# EAGLE design rov_control (EAGLE 6.4)
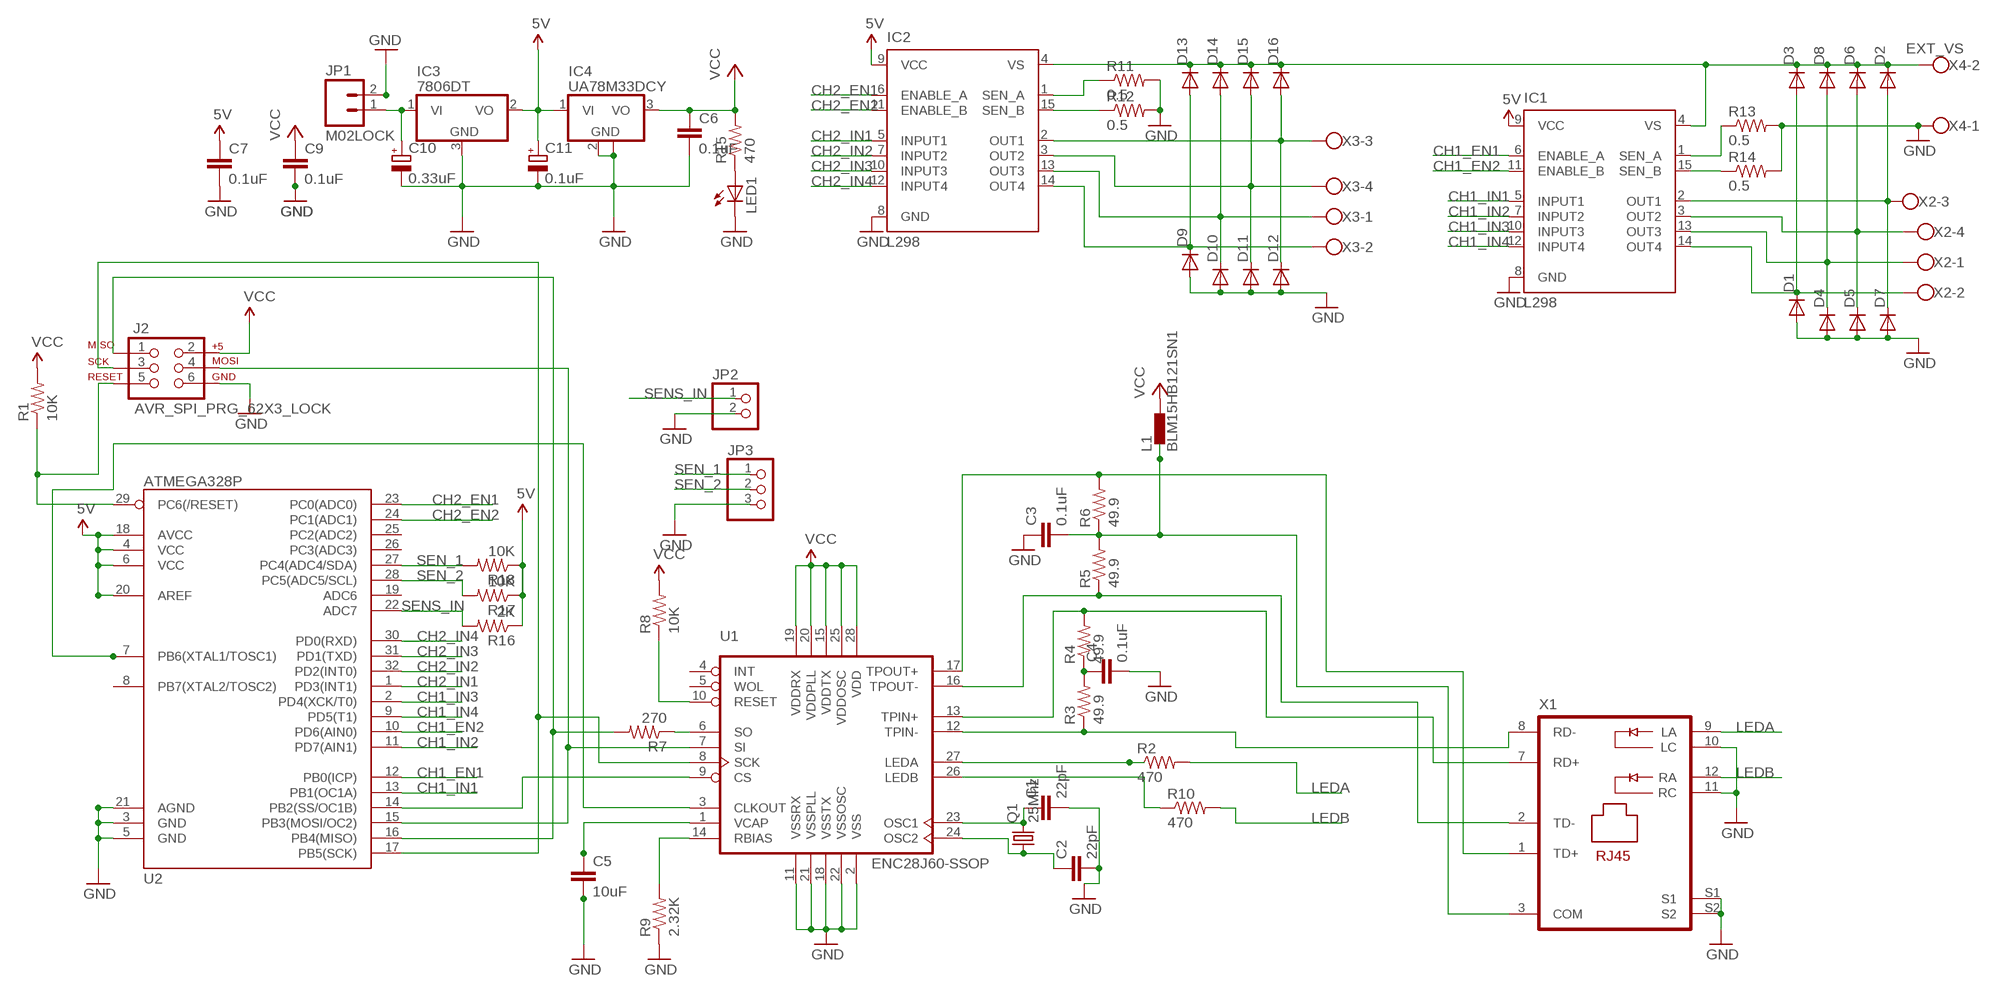
[diagram p0: schematic, sheet 1]

## Parts
C1  22pF  CAP0805  [0805]
C2  22pF  CAP0805  [0805]
C3  0.1uF  CAP0805  [0805]
C4  0.1uF  CAP0805  [0805]
C5  10uF  CAP0805  [0805]
C6  0.1uF  CAP0805  [0805]
C7  0.1uF  CAP0805  [0805]
C9  0.1uF  CAP0805  [0805]
C10  0.33uF  CPOL-EUA  [PANASONIC_A]
C11  0.1uF  CPOL-EUA  [PANASONIC_A]
D1  DIODESMA  [SMA-DIODE]
D2  DIODESMA  [SMA-DIODE]
D3  DIODESMA  [SMA-DIODE]
D4  DIODESMA  [SMA-DIODE]
D5  DIODESMA  [SMA-DIODE]
D6  DIODESMA  [SMA-DIODE]
D7  DIODESMA  [SMA-DIODE]
D8  DIODESMA  [SMA-DIODE]
D9  DIODESMA  [SMA-DIODE]
D10  DIODESMA  [SMA-DIODE]
D11  DIODESMA  [SMA-DIODE]
D12  DIODESMA  [SMA-DIODE]
D13  DIODESMA  [SMA-DIODE]
D14  DIODESMA  [SMA-DIODE]
D15  DIODESMA  [SMA-DIODE]
D16  DIODESMA  [SMA-DIODE]
IC1  L298  [MULTIWATT-15]
IC2  L298  [MULTIWATT-15]
IC3  7806DT  [TO252]
IC4  UA78M33DCY  [SOT223]
J2  AVR_SPI_PRG_62X3_LOCK  [2X3_LOCK]
JP1  M02LOCK  [1X02_LOCK]
JP2  PINHD-1X2  [1X02]
JP3  PINHD-1X3  [1X03]
L1  BLM15HB121SN1  [0402]
LED1  LEDSML0805  [SML0805]
Q1  25Mhz  CRYSTALHC49UP  [HC49UP]
R1  10K  RESISTOR0805-RES  [0805]
R2  470  RESISTOR0805-RES  [0805]
R3  49.9  RESISTOR0805-RES  [0805]
R4  49.9  RESISTOR0805-RES  [0805]
R5  49.9  RESISTOR0805-RES  [0805]
R6  49.9  RESISTOR0805-RES  [0805]
R7  270  RESISTOR0805-RES  [0805]
R8  10K  RESISTOR0805-RES  [0805]
R9  2.32K  RESISTOR0805-RES  [0805]
R10  470  RESISTOR0805-RES  [0805]
R11  0.5  RESISTOR0805-RES  [0805]
R12  0.5  RESISTOR0805-RES  [0805]
R13  0.5  RESISTOR0805-RES  [0805]
R14  0.5  RESISTOR0805-RES  [0805]
R15  470  RESISTOR0805-RES  [0805]
R16  2K  RESISTOR0805-RES  [0805]
R17  10K  RESISTOR0805-RES  [0805]
R18  10K  RESISTOR0805-RES  [0805]
U1  ENC28J60-SSOP  [SSOP28]
U2  ATMEGA328P  ATMEGA328_SMT  [TQFP32-08]
X1  LU1T041X  [PJ-J0]
X2  W237-4  [W237-4]
X3  W237-4  [W237-4]
X4  EXT_VS  W237-102  [W237-102]

## Nets
5V: C7.1 C11.+ IC1.9(VCC) IC2.9(VCC) IC3.2(VO) IC4.1(VI) R16.1 R17.1 R18.1 U2.4(VCC) U2.6(VCC) U2.18(AVCC) U2.20(AREF)
CH1_EN1: IC1.6(ENABLE_A) U2.12(PB0(ICP))
CH1_EN2: IC1.11(ENABLE_B) U2.10(PD6(AIN0))
CH1_IN1: IC1.5(INPUT1) U2.13(PB1(OC1A))
CH1_IN2: IC1.7(INPUT2) U2.11(PD7(AIN1))
CH1_IN3: IC1.10(INPUT3) U2.2(PD4(XCK/T0))
CH1_IN4: IC1.12(INPUT4) U2.9(PD5(T1))
CH1_OUT1: D2.A D7.C IC1.2(OUT1) X2.3
CH1_OUT2: D4.C D8.A IC1.13(OUT3) X2.1
CH1_OUT3: D5.C D6.A IC1.3(OUT2) X2.4
CH1_OUT4: D1.C D3.A IC1.14(OUT4) X2.2
CH2_EN1: IC2.6(ENABLE_A) U2.23(PC0(ADC0))
CH2_EN2: IC2.11(ENABLE_B) U2.24(PC1(ADC1))
CH2_IN1: IC2.5(INPUT1) U2.1(PD3(INT1))
CH2_IN2: IC2.7(INPUT2) U2.32(PD2(INT0))
CH2_IN3: IC2.10(INPUT3) U2.31(PD1(TXD))
CH2_IN4: IC2.12(INPUT4) U2.30(PD0(RXD))
CH2_OUT1: D12.C D16.A IC2.2(OUT1) X3.3
CH2_OUT2: D11.C D15.A IC2.3(OUT2) X3.4
CH2_OUT3: D10.C D14.A IC2.13(OUT3) X3.1
CH2_OUT4: D9.C D13.A IC2.14(OUT4) X3.2
EXT_V: D2.C D3.C D6.C D8.C D13.C D14.C D15.C D16.C IC1.4(VS) IC2.4(VS) X4.2
GND: C1.2 C2.2 C3.1 C4.2 C5.2 C6.2 C7.2 C9.2 C10.- C11.- D1.A D4.A D5.A D7.A D9.A D10.A D11.A D12.A IC1.8(GND) IC2.8(GND) IC3.3(GND) IC4.2(GND) IC4.4(GND) J2.6 JP1.2 JP2.2 JP3.3 LED1.C R9.1 R11.2 R12.2 R13.2 R14.2 U1.2(VSS) U1.11(VSSRX) U1.18(VSSTX) U1.21(VSSPLL) U1.22(VSSOSC) U2.3(GND) U2.5(GND) U2.21(AGND) X1.10(LC) X1.11(RC) X1.S1 X1.S2 X4.1
LEDA: R2.2 X1.9(LA)
LEDB: R10.2 X1.12(RA)
N$1: C2.1 Q1.1 U1.24(OSC2)
N$2: C1.1 Q1.2 U1.23(OSC1)
N$4: J2.3 U1.8(SCK) U2.17(PB5(SCK))
N$5: J2.5 R1.1 U2.29(PC6(/RESET))
N$6: R2.1 U1.27(LEDA)
N$8: R10.1 U1.26(LEDB)
N$9: C4.1 R3.2 R4.1
N$13: J2.1 R7.2 U2.16(PB4(MISO))
N$14: R7.1 U1.6(SO)
N$15: J2.4 U1.7(SI) U2.15(PB3(MOSI/OC2))
N$16: U1.9(CS) U2.14(PB2(SS/OC1B))
N$19: R8.1 U1.10(RESET)
N$20: LED1.A R15.1
N$22: R9.2 U1.14(RBIAS)
N$23: C5.1 U1.1(VCAP)
N$24: U1.3(CLKOUT) U2.7(PB6(XTAL1/TOSC1))
N$25: C10.+ IC3.1(VI) JP1.1
N$27: IC2.1(SEN_A) R11.1
N$28: IC2.15(SEN_B) R12.1
N$30: IC1.1(SEN_A) R13.1
N$31: IC1.15(SEN_B) R14.1
N-COM: R5.1 U1.16(TPOUT-) X1.2(TD-)
RD+: R4.2 U1.13(TPIN+) X1.7(RD+)
RD-: R3.1 U1.12(TPIN-) X1.8(RD-)
SEN_1: JP3.1 R18.2 U2.27(PC4(ADC4/SDA))
SEN_2: JP3.2 R17.2 U2.28(PC5(ADC5/SCL))
SENS_IN: JP2.1 R16.2 U2.22(ADC7)
TD+: R6.2 U1.17(TPOUT+) X1.1(TD+)
TD-: C3.2 L1.1 R5.2 R6.1 X1.3(COM)
VCC: C6.1 C9.1 IC4.3(VO) J2.2 L1.2 R1.2 R8.2 R15.2 U1.15(VDDTX) U1.19(VDDRX) U1.20(VDDPLL) U1.25(VDDOSC) U1.28(VDD)
Unconnected: U1.4(INT) U1.5(WOL) U2.8(PB7(XTAL2/TOSC2)) U2.19(ADC6) U2.25(PC2(ADC2)) U2.26(PC3(ADC3))

## Library data of the parts
C1-C5 C7 C9 = SparkFun-Capacitors:CAP: Capacitor Standard 0603 ceramic capacitor, and 0.1" leaded capacitor.
C6 = SparkFun-Passives:CAP: Capacitor Standard 0603 ceramic capacitor, and 0.1" leaded capacitor.
C10 C11 = resistor:CPOL-EU: POLARIZED CAPACITOR, European symbol
D1-D16 = SparkFun-DiscreteSemi:DIODE: Diode These are standard reverse protection diodes and small signal diodes. SMA package can handle up to about 1A. SOD-323 can handle about 200mA. What the SOD-323 package when ordering, there are some mfgs out there that are 5-pin packages.
IC1 IC2 = st-microelectronics:L298: DUAL FULL-BRIDGE DRIVER; MPN: L298N; OC_FARNELL: 1589425; OC_NEWARK: 32M1527
IC3 = linear:78*: Positive VOLTAGE REGULATOR Source: http://cache.national.com/ds/LM/LM78L05.pdf http://www.fairchildsemi.com/ds/LM/LM7805.pdf
IC4 = linear:UA78M*: POSITIVE-VOLTAGE REGULATORS Source: http://focus.ti.com/lit/ds/symlink/ua78m33.pdf
J2 = SparkFun-Connectors:AVR_SPI_PRG_6: AVR ISP 6 Pin This is the reduced ISP connector for AVR programming. Common on Arduino. This footprint will take up less PCB space and can be used with a 10-pin to 6-pin adapter such as SKU: BOB-08508
JP1 = SparkFun-Connectors:M02: Standard 2-pin 0.1" header. Use with - straight break away headers ( PRT-00116) - right angle break away headers (PRT-00553) - swiss pins (PRT-00743) - machine pins (PRT-00117) - female headers (PRT-00115) Molex polarized connector foot print use with: PRT-08233 with associated crimp pins and housings. 2.54_SCREWTERM for use with PRT-10571. 3.5mm Screw Terminal footprints for PRT-08084 5mm Screw Terminal footprints for use with PRT-08433
JP2 = pinhead:PINHD-1X2: PIN HEADER
JP3 = pinhead:PINHD-1X3: PIN HEADER
L1 = inductors:BLM15H: EMIFIL (R) Chip Ferrite Bead for GHz Noise Source: http://www.murata.com/ Ferrite Bead BLM15H.pdf
LED1 = led:LED: LED OSRAM: - CHIPLED LG R971, LG N971, LY N971, LG Q971, LY Q971, LO R971, LY R971 LH N974, LH R974 LS Q976, LO Q976, LY Q976 LO Q996 - Hyper CHIPLED LW Q18S LB Q993, LB Q99A, LB R99A - SideLED LS A670, LO A670, LY A670, LG A670, LP A670 LB A673, LV A673, LT A673, LW A673 LH A674 LY A675 LS A676, LA A676, LO A676, LY A676, LW A676 LS A679, LY A679, LG A679 - Hyper Micro SIDELED® LS Y876, LA Y876, LO Y876, LY Y876 LT Y87S - SmartLED LW L88C, LW L88S LB L89C, LB L89S, LG L890 LS L89K, LO L89K, LY L89K LS L896, LA L896, LO L896, LY L896 - TOPLED LS T670, LO T670, LY T670, LG T670, LP T670 LSG T670, LSP T670, LSY T670, LOP T670, LYG T670 LG T671, LOG T671, LSG T671 LB T673, LV T673, LT T673, LW T673 LH T674 LS T676, LA T676, LO T676, LY T676, LB T676, LH T676, LSB T676, LW T676 LB T67C, LV T67C, LT T67C, LS T67K, LO T67K, LY T67K, LW E67C LS E67B, LA E67B, LO E67B, LY E67B, LB E67C, LV E67C, LT E67C LW T67C LS T679, LY T679, LG T679 LS T770, LO T770, LY T770, LG T770, LP T770 LB T773, LV T773, LT T773, LW T773 LH T774 LS E675, LA E675, LY E675, LS T675 LS T776, LA T776, LO T776, LY T776, LB T776 LHGB T686 LT T68C, LB T68C - Hyper Mini TOPLED® LB M676 - Mini TOPLED Santana® LG M470 LS M47K, LO M47K, LY M47K Source: http://www.osram.convergy.de LUXEON: - LUMILED® LXK2-PW12-R00, LXK2-PW12-S00, LXK2-PW14-U00, LXK2-PW14-V00 LXK2-PM12-R00, LXK2-PM12-S00, LXK2-PM14-U00 LXK2-PE12-Q00, LXK2-PE12-R00, LXK2-PE12-S00, LXK2-PE14-T00, LXK2-PE14-U00 LXK2-PB12-K00, LXK2-PB12-L00, LXK2-PB12-M00, LXK2-PB14-N00, LXK2-PB14-P00, LXK2-PB14-Q00 LXK2-PR12-L00, LXK2-PR12-M00, LXK2-PR14-Q00, LXK2-PR14-R00 LXK2-PD12-Q00, LXK2-PD12-R00, LXK2-PD12-S00 LXK2-PH12-R00, LXK2-PH12-S00 LXK2-PL12-P00, LXK2-PL12-Q00, LXK2-PL12-R00 Source: www.luxeon.com KINGBRIGHT: KA-3528ASYC Source: www.kingbright.com
Q1 = crystal:CRYSTAL: CRYSTAL; OC_FARNELL: unknown; OC_NEWARK: unknown
R1 R3 R4 R7 R16-R18 = SparkFun-Resistors:RESISTOR: Resistor Basic schematic elements and footprints for 0603, 1206, and PTH resistors.
R2 R5 R6 R8-R15 = SparkFun-Passives:RESISTOR: Resistor Basic schematic elements and footprints for 0603, 1206, and PTH resistors.
U1 = microchip-enc28j60:ENC28J60-*: Microchip 10Mbit Eth. contoller with SPI interface
U2 = SparkFun-DigitalIC:ATMEGA328_SMT: 32-Pin Atmega328 part Commonly used on Arduino compatible boards Available in QFP and QFN packages TQFP is IC-09069 QFN is non-stock; PROD_ID: IC-09069
X1 = con-magjack:LU1T041X: 8P8C (RJ-45) MagJack connector
X2 X3 = con-wago-500:W237-4: WAGO SCREW CLAMP; OC_FARNELL: unknown; OC_NEWARK: unknown
X4 = con-wago-500:W237-102: WAGO SCREW CLAMP; MPN: 237-102; OC_FARNELL: unknown; OC_NEWARK: 70K9898

## Board
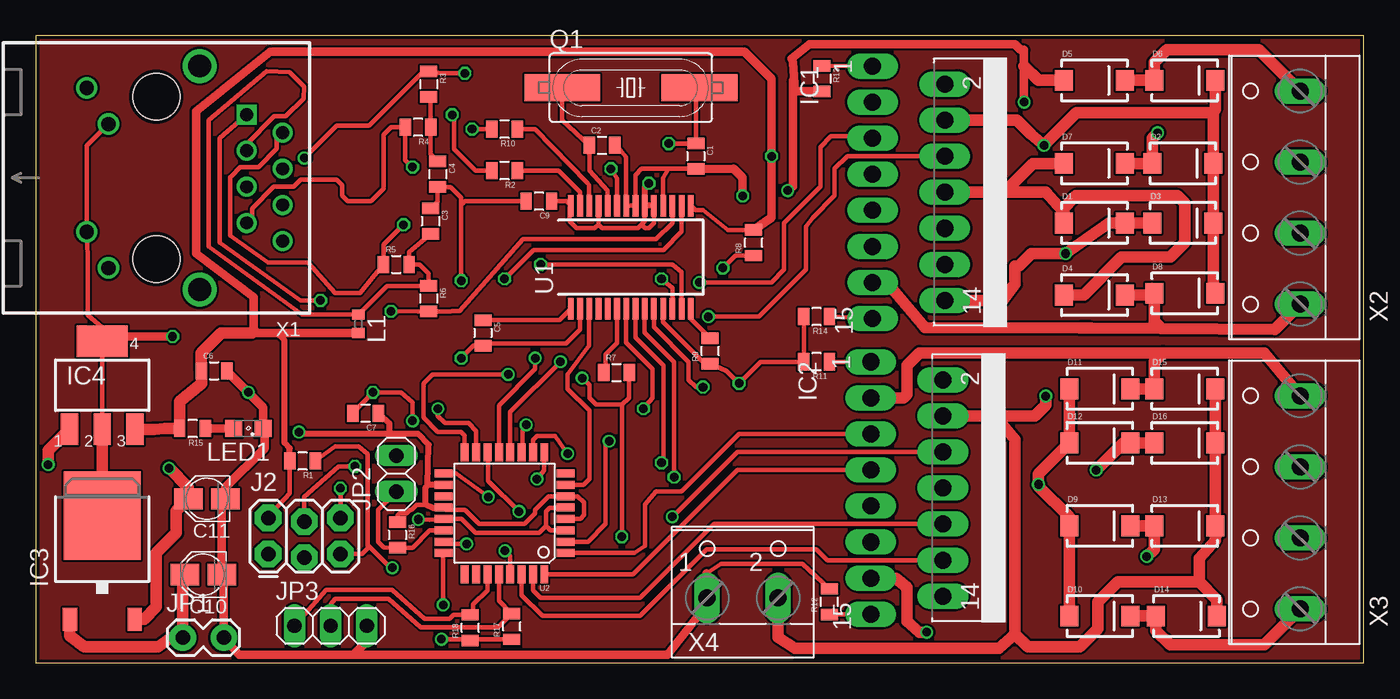
[diagram p1: board, top side]
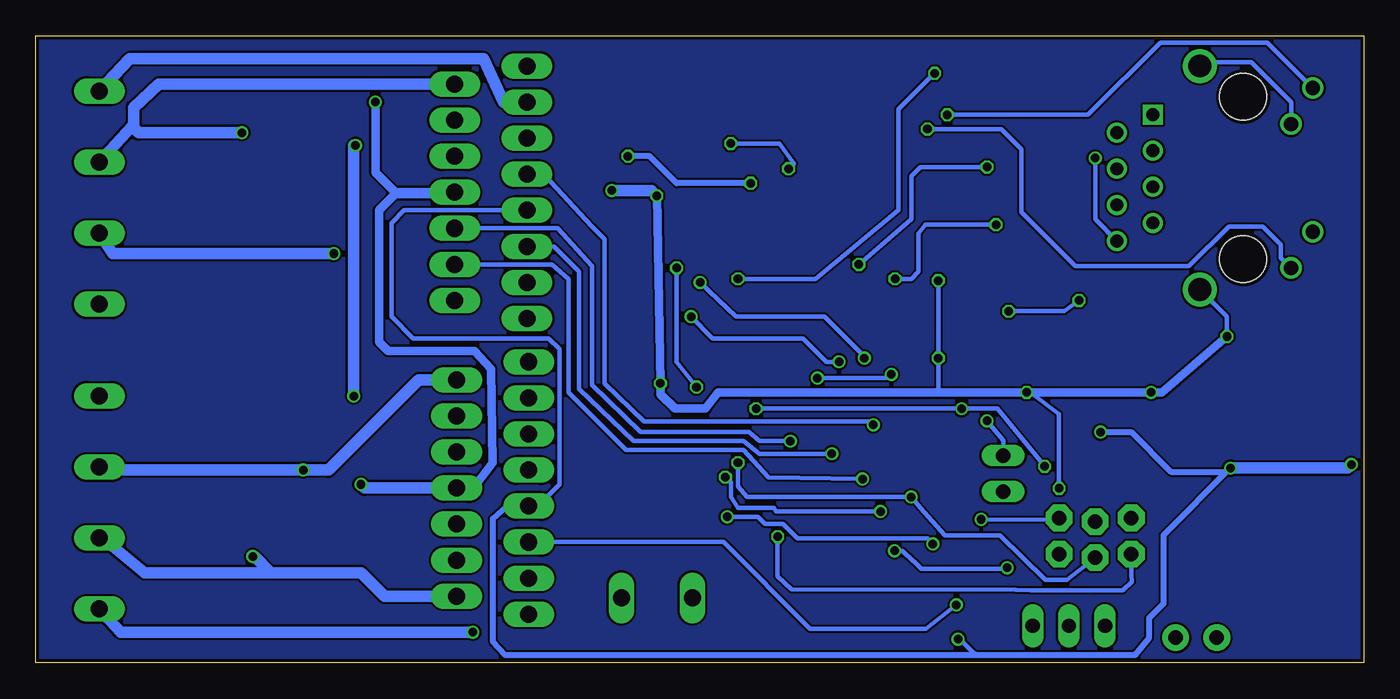
[diagram p2: board, bottom side, seen from below]

Size 93.52 x 44.16 mm. Coordinates in mm from the lower left corner, seen from the top.
Outline: 0,0 93.52,0 93.52,44.16 0,44.16 0,0
Copper layers (1*16): Top 0.035mm / dielectric 1.5mm / Bottom 0.035mm
Design rules "Elecrow_2-layer_eagle_rule": minimum track width 6mil, minimum drill 12mil, track to track 6mil, track to pad 6mil, pad to pad 6mil, via to via 6mil, smd to smd 0mil, copper to edge 10mil, drill to drill 10mil, minimum pad ring 10mil, minimum via ring 6mil, stop-mask expansion 2mil, vias tented up to drill 100mil, thermal gap 10mil

### Footprints (pad centres in the part's own frame; a part is rotated, then mirrored left to right if it is on the bottom)
0805 = smd 0.8 x 1.2: 1 -0.9,0; 2 0.9,0
PANASONIC_A = smd 2 x 1.5: + 1.3,0; - -1.3,0
SMA-DIODE = smd 1.27 x 1.47: A -2.15,0; C 2.15,0
MULTIWATT-15 = drill 1.2 long: 1 -8.89,-7.62; 2 -7.62,-2.54; 3 -6.35,-7.62; 4 -5.08,-2.54; 5 -3.81,-7.62; 6 -2.54,-2.54; 7 -1.27,-7.62; 8 0,-2.54; 9 1.27,-7.62; 10 2.54,-2.54; 11 3.81,-7.62; 12 5.08,-2.54; 13 6.35,-7.62; 14 7.62,-2.54; 15 8.89,-7.62
TO252 = smd 1 x 1.6: 1 -2.28,-4.8; 2 2.28,-4.8 | smd 5.4 x 6.2: 3 0,2.5
SOT223 = smd 1.219 x 2.235: 1 -2.311,-3.099; 2 0,-3.099; 3 2.311,-3.099 | smd 3.6 x 2.2: 4 0,3.099
2X3_LOCK = drill 1.016 pad 1.88 octagon: 1 0,0; 2 0,2.54; 3 2.54,-0.254; 4 2.54,2.286; 5 5.08,0; 6 5.08,2.54
1X02_LOCK = drill 1.016 pad 1.88: 1 -0.178,0; 2 2.718,0
1X02 = drill 1.016 long: 1 -1.27,0; 2 1.27,0
1X03 = drill 1.016 long: 1 -2.54,0; 2 0,0; 3 2.54,0
0402 = smd 0.7 x 0.9: 1 -0.65,0; 2 0.65,0
SML0805 = smd 1.2 x 1.2: A 1.05,0; C -1.05,0
HC49UP = smd 5.334 x 1.93: 1 -4.826,0; 2 4.826,0
SSOP28 = smd 0.4 x 1.5: 1 -4.225,-3.625; 2 -3.575,-3.625; 3 -2.925,-3.625; 4 -2.275,-3.625; 5 -1.625,-3.625; 6 -0.975,-3.625; 7 -0.325,-3.625; 8 0.325,-3.625; 9 0.975,-3.625; 10 1.625,-3.625; 11 2.275,-3.625; 12 2.925,-3.625; 13 3.575,-3.625; 14 4.225,-3.625; 15 4.225,3.625; 16 3.575,3.625; 17 2.925,3.625; 18 2.275,3.625; 19 1.625,3.625; 20 0.975,3.625; 21 0.325,3.625; 22 -0.325,3.625; 23 -0.975,3.625; 24 -1.625,3.625; 25 -2.275,3.625; 26 -2.925,3.625; 27 -3.575,3.625; 28 -4.225,3.625
TQFP32-08 = smd 1.27 x 0.559: 1 -4.293,2.8; 2 -4.293,2; 3 -4.293,1.2; 4 -4.293,0.4; 5 -4.293,-0.4; 6 -4.293,-1.2; 7 -4.293,-2; 8 -4.293,-2.8; 17 4.293,-2.8; 18 4.293,-2; 19 4.293,-1.2; 20 4.293,-0.4; 21 4.293,0.4; 22 4.293,1.2; 23 4.293,2; 24 4.293,2.8 | smd 0.559 x 1.27: 9 -2.8,-4.293; 10 -2,-4.293; 11 -1.2,-4.293; 12 -0.4,-4.293; 13 0.4,-4.293; 14 1.2,-4.293; 15 2,-4.293; 16 2.8,-4.293; 25 2.8,4.293; 26 2,4.293; 27 1.2,4.293; 28 0.4,4.293; 29 -0.4,4.293; 30 -1.2,4.293; 31 -2,4.293; 32 -2.8,4.293
PJ-J0 = drill 0.9 square: 1 4.445,-6.35 | drill 0.9: 2 3.175,-8.89; 3 1.905,-6.35; 4 0.635,-8.89; 5 -0.635,-6.35; 6 -1.905,-8.89; 7 -3.175,-6.35; 8 -4.445,-8.89 | drill 1: 9 6.325,4.902; 10 3.785,3.378; 11 -3.81,4.902; 12 -6.35,3.378 | drill 1.6: S1 -7.874,-3.048; S2 7.874,-3.048 | hole 3.3: -5.715,0; 5.715,0
W237-4 = drill 1.194 long: 1 -7.5,-1.27; 2 -2.5,-1.27; 3 2.5,-1.27; 4 7.5,-1.27
W237-102 = drill 1.194 long: 1 -2.5,-1.27; 2 2.5,-1.27

### Placement (x,y rotation side)
C1  46.48,35.66 270 top
C2  39.88,36.42 0 top
C3  27.81,31.09 270 top
C4  28.32,34.39 270 top
C5  31.5,23.22 270 top
C6  12.57,20.55 0 top
C7  23.24,17.55 180 top
C9  35.43,32.49 180 top
C10  11.81,6.2 180 top
C11  12.06,11.53 180 top
D1  74.55,30.96 0 top
D2  80.77,35.15 0 top
D3  80.77,30.96 0 top
D4  74.55,25.88 0 top
D5  74.55,41 0 top
D6  80.9,41 0 top
D7  74.55,35.15 0 top
D8  80.9,26.01 0 top
D9  74.93,9.63 0 top
D10  74.93,3.28 0 top
D11  74.93,19.28 0 top
D12  74.93,15.47 0 top
D13  80.9,9.63 0 top
D14  81.03,3.28 0 top
D15  80.9,19.28 0 top
D16  80.9,15.47 0 top
IC1  66.55,33.12 270 top
IC2  66.42,12.29 270 top
IC3  4.7,7.85 0 top
IC4  4.7,19.53 0 top
J2  16.38,7.65 0 top
JP1  10.54,1.75 0 top
JP2  25.4,13.31 90 top
JP3  20.78,2.59 0 top
L1  22.73,23.85 270 top
LED1  14.99,16.48 180 top
Q1  41.91,40.49 0 top
R1  18.8,14.2 180 top
R2  33.02,34.65 180 top
R3  27.69,40.74 270 top
R4  26.92,37.69 180 top
R5  25.4,28.04 0 top
R6  27.69,25.63 270 top
R7  40.89,20.42 0 top
R8  50.55,29.57 90 top
R9  47.5,21.95 90 top
R10  33.02,37.57 180 top
R11  54.99,21.18 180 top
R12  55.88,4.29 90 top
R13  55.37,41.12 270 top
R14  54.99,24.36 180 top
R15  11.05,16.48 180 top
R16  25.48,8.99 270 top
R17  33.53,2.54 90 top
R18  30.61,2.46 90 top
U1  41.91,28.55 0 top
U2  33.02,10.52 180 top
X1  8.51,34.14 90 top
X2  87.76,32.74 90 top
X3  87.76,11.28 90 top
X4  49.78,5.82 0 top

### Tracks (layer width: path | path; a pad name or v marks a point on that pad's centre or on a via)
5V  (via drill 0.6)
  Top 0.305: U2.20 28.87,10.77 30.23,10.77 31.24,9.75 34.42,9.75 35.18,10.52 35.18,10.77 36.12,11.72 U2.6 38.17,11.72 38.61,11.28 38.61,10.39 38.35,10.13 37.33,10.13 U2.4 | R16.1 25.48,10.36 25.63,10.52 26.11,10.52 26.36,10.77 26.49,10.77 26.82,11.1 27.38,11.1 27.43,11.15 | R17.1 30.68,1.64 | 30.68,1.64 R18.1 | 30.68,1.64 28.59,1.64 v28.57,1.65
  Top 0.406: C7.1 24.9,16.85 24.89,16.1 | 24.89,16.1 18.67,16.1 v18.54,16.23 | 27.65,12.52 27.59,12.52 27.69,15.34 26.92,16.1 24.89,16.1 | 27.65,12.52 27.43,12.29 27.43,11.15 27.94,10.9 28.71,10.9 U2.20 | U2.18 27.65,12.52
  Top 0.813: IC3.2 7.65,3.05 8.51,3.91 8.51,7.72 9.91,9.12 9.91,10.67 C11.+ 10.77,12.32 v9.4,13.69 | v0.89,13.94 0.89,14.94 IC4.1
  Bottom 0.305: IC1.9 67.56,31.85 68.45,30.96 68.45,24.36 66.93,22.83 57.4,22.83 56.64,22.07 56.64,12.55 58.17,11.02 IC2.9 | v28.57,1.65 28.45,1.65 27.35,0.55
  Bottom 0.406: v18.54,16.23 16.38,16.23 13.59,13.44 9.65,13.44 v9.4,13.69 14.1,8.99 14.1,4.17 15.11,3.15 15.11,1.75 16.1,0.53 27.35,0.55 60.45,0.53 61.34,1.5 61.34,10.13 60.33,11.02 IC2.9
  Bottom 0.813: v9.4,13.69 1.14,13.69 v0.89,13.94
CH1_EN1  (via drill 0.6)
  Top 0.305: U2.12 33.42,17.65 v36.96,21.18 | v47.37,24.36 50.93,24.36 54.23,27.66 54.23,30.71 54.74,31.34 56.26,32.87 56.26,34.77 57.15,35.66 IC1.6
  Bottom 0.305: v36.96,21.18 37.85,21.18 39.5,22.83 45.85,22.83 v47.37,24.36
CH1_EN2  (via drill 0.6)
  Top 0.305: U2.10 35.02,15.69 35.31,15.98 36.58,15.98 v37.47,14.71
  Bottom 0.305: v37.47,14.71 42.55,14.71 43.69,15.6 51.44,15.6 55.24,19.28 55.24,27.53 57.02,29.31 IC1.11
CH1_IN1  (via drill 0.6)
  Top 0.305: U2.13 32.62,18.12 35.18,20.68 v35.18,21.44 | v46.74,26.77 51.82,26.77 52.7,27.66 52.7,30.96 55.24,33.5 55.24,36.3 56.01,37.06 58.8,37.06 IC1.5
  Bottom 0.305: v35.18,21.44 35.18,21.56 37.97,24.36 44.2,24.36 v46.74,26.77
CH1_IN2  (via drill 0.6)
  Top 0.305: v34.54,16.74 34.54,16.61 34.29,16.36 34.29,14.88 U2.11
  Bottom 0.305: IC1.7 57.78,34.39 57.28,33.88 54.36,30.71 53.47,29.82 53.47,19.66 50.67,16.99 34.8,16.99 v34.54,16.74
CH1_IN3  (via drill 0.6)
  Top 0.305: U2.2 38.89,8.52 40.13,9.75 40.13,15.47 v40.39,15.6
  Bottom 0.305: IC1.10 56.77,30.58 54.36,27.91 54.36,19.53 50.93,16.23 43.31,16.23 42.55,15.6 v40.39,15.6
CH1_IN4  (via drill 0.6)
  Top 0.305: U2.9 35.79,13.54 v35.31,12.93
  Bottom 0.305: v35.31,12.93 41.91,13.06 43.69,14.96 51.94,14.96 56.01,19.02 56.01,27.03 57.15,28.04 IC1.12
CH1_OUT1  (via drill 0.6)
  Top 0.813: D7.C D2.A 78.62,36.94 v78.99,37.31
  Bottom 0.813: IC1.2 84.84,40.74 86.61,39.09 86.61,37.91 86.73,37.78 | 86.73,37.78 X2.3 | v78.99,37.31 86.27,37.31 86.73,37.78
CH1_OUT2
  Top 0.813: IC1.13 59.94,26.77 62.61,23.6 73.53,23.54 | 73.53,23.54 79.25,23.51 | 79.25,23.51 87.26,23.47 X2.1 | 79.25,23.51 78.75,24.01 D8.A 78.62,25.88 D4.C | 74.3,23.55 73.53,23.54
CH1_OUT3
  Top 0.813: D5.C D6.A 78.75,42.27 79.63,43.15 86.11,43.15 X2.4
  Bottom 0.813: IC1.3 60.58,39.47 61.98,42.52 86.88,42.52 X2.4
CH1_OUT4  (via drill 0.6)
  Top 0.813: IC1.14 68.07,25.5 68.96,26.64 68.96,27.91 69.22,27.91 70.1,28.8 v72.52,28.8 75.56,30.96 D1.C D3.A
  Bottom 0.813: v72.52,28.8 88.1,28.8 X2.2
CH2_EN1  (via drill 0.6)
  Top 0.305: IC2.6 49.4,14.83 v44.83,10.26 | v30.35,8.36 28.89,8.36 U2.23
  Bottom 0.305: v44.83,10.26 42.67,10.26 42.16,9.75 40.89,9.75 39.88,8.74 30.73,8.74 v30.35,8.36
CH2_EN2  (via drill 0.6)
  Top 0.305: v28.7,4.06 28.7,7.69 U2.24
  Bottom 0.305: IC2.11 45.09,8.48 38.99,2.39 30.84,2.39 v28.7,4.06
CH2_IN1
  Top 0.305: U2.1 42.16,7.72 42.93,8.23 42.93,11.15 43.69,12.04 45.47,12.04 49.53,16.1 IC2.5
CH2_IN2
  Top 0.305: U2.32 42.06,6.22 49.4,13.56 IC2.7
CH2_IN3
  Top 0.305: U2.31 35.02,5.09 35.56,4.55 42.55,4.55 47.75,9.75 IC2.10
CH2_IN4
  Top 0.305: U2.30 34.22,4.74 35.69,3.28 42.55,3.28 47.24,7.98 54.99,7.98 55.75,7.21 IC2.12
CH2_OUT1  (via drill 0.6)
  Top 0.813: D16.A D12.C 76.58,15.47 v74.68,13.56
  Bottom 0.813: IC2.2 66.55,19.91 72.9,13.56 v74.68,13.56 88.81,13.56 X3.3
CH2_OUT2
  Top 0.813: IC2.3 61.09,18.64 61.34,18.9 61.34,19.28 61.34,20.93 62.23,21.82 79.38,21.82 | 79.38,21.82 86.49,21.82 X3.4 | D11.C D15.A 78.75,21.19 79.38,21.82
CH2_OUT3  (via drill 0.6)
  Top 0.813: IC2.13 60.58,5.94 61.34,5.31 61.34,2.9 62.23,2.13 v62.74,2.13 | D10.C D14.A 78.88,2.25 79.88,1.24 86.49,1.24 X3.1
  Bottom 0.813: v62.74,2.13 87.51,2.13 X3.1
CH2_OUT4  (via drill 0.6)
  Top 0.813: D9.C D13.A 78.75,7.98 v78.23,7.47
  Bottom 0.813: IC2.14 68.96,4.67 70.61,6.32 76.96,6.32 | 76.96,6.32 85.85,6.32 88.9,8.86 89.11,8.86 X3.2 | v78.23,7.47 78.11,7.47 76.96,6.32
EXT_V  (via drill 0.6)
  Top 0.61: 65.66,17.25 IC2.4
  Top 0.813: X4.2 52.28,1.79 53.47,0.99 67.82,0.99 68.96,2.01 | 68.96,2.01 68.96,15.72 67.56,17.37 | IC1.4 69.09,38.2 70.1,37.19 v70.99,36.42 73.28,38.71 82.8,38.71 | IC2.4 67.56,17.37 | 67.56,17.37 70.36,17.37 71.12,18.14 v71.12,18.77 | D6.C 83.05,38.95 82.8,38.71 | D8.C 82.92,26.14 D3.C D2.C 82.92,38.59 82.8,38.71 | D15.C D16.C D13.C | 83.18,8.99 D13.C | D13.C 83.05,8.61 81.92,7.35 81.92,5.69 | D14.C 83.18,4.43 81.92,5.69 | 81.92,5.69 76.2,5.69 74.8,4.29 74.8,2.39 73.53,1.12 69.85,1.12 68.96,2.01
  Bottom 0.813: v71.12,18.77 71.12,36.42 v70.99,36.42
GND  (via drill 0.6)
  Top 0.305: C3.1 28.32,32.48 C4.2 29.22,33.49 29.97,32.74 29.97,32.23 | IC4.2 IC4.4 4.7,23.6 3.68,24.49 3.68,28.63 X1.11 3.61,36.4 X1.10 | C2.2 40.89,36.42 41.59,35.61 U1.22 U1.21 42.23,34.34 42.67,34.77 44.58,34.77 | U1.18 44.19,34.13 44.58,34.77 | 44.58,34.77 46.48,34.77 | 46.49,34.77 C1.2 | U1.11 44.19,23.99 46.99,21.18 47.36,21.18 R9.1 48.65,20.54 v49.53,19.66 51.05,21.18 R11.2 R14.2 | U1.2 38.34,23.45 37.34,22.45 31.63,22.45 C5.2 30.85,22.32 v29.97,21.44 | 29.97,32.23 v29.97,26.9 | C9.2 30.23,32.49 29.97,32.23 | J2.6 v21.46,12.27 | U2.3 36.25,9.32 35.94,9.63 | 35.94,9.63 35.94,10.64 36.2,10.9 37.29,10.9 U2.5 | 35.94,9.63 35.43,9.12 30.99,9.12 29.99,10.12 U2.21 27.76,10.06 v26.95,10.08 | R12.2 53.98,6.96 48.26,6.96 47.24,6.28 X4.1 | C6.2 13.47,20.54 | C7.2 23.74,19.01 v23.75,19.02 25.73,19.02 26.54,18.31 v26.54,17.02
  Top 0.61: 46.49,34.77 46.48,34.77 C1.2 49.15,34.77 49.78,34.14 v49.78,32.87 | v9.65,22.96 6.55,22.96 IC4.4 | R13.2 53.47,40.23 | 53.47,40.23 53.34,41 53.34,33.5 v52.96,33.25 | 47.24,6.28 47.24,4.04 44.5,0.56 22.4,0.56 | 22.4,0.56 14.35,0.56 JP1.2 13.26,6.05 C10.- 13.11,11.28 C11.- 13.37,12.32 16.13,15.09 16.13,16.39 LED1.C 16.04,17.97 v14.99,19.02 13.47,20.54 | v69.6,39.47 69.6,42.01 69.6,43.15 69.34,43.15 68.96,43.54 54.48,43.54 53.21,42.52 53.34,42.27 53.47,40.23 | JP3.3 23.37,1.57 22.4,0.56
  Top 0.813: IC3.3 IC4.2 | 72.25,31.88 72.39,31.72 D1.A 72.4,30.82 | 72.25,31.88 71.12,33.12 68.2,33.12 | 68.2,33.12 IC1.8 | D7.A 70.23,35.15 68.2,33.12 | D5.A 70.61,41 69.6,42.01 | D11.A D12.A 70.61,13.3 v70.61,12.55 70.61,12.42 72.78,10.25 D9.A D10.A | D4.A 73.79,25.88 76.45,28.55 79.88,28.55 80.9,29.57 80.9,32.36 80.39,32.87 73.24,32.87 72.25,31.88
  Bottom 0.305: v29.97,26.9 v29.97,21.44 29.97,19.02 | v21.46,12.27 21.46,17.5 23.5,19.02 | v26.95,10.08 21.69,10.03 J2.6 | JP2.2 25.4,15.65 v26.54,17.02 | v9.65,22.96 9.65,24.36 X1.S1 | X1.10 5.13,39.47 7.92,42.27 11.3,42.27 X1.S2
  Bottom 0.61: v49.78,32.87 v49.53,19.66 49.53,18.9 48.51,17.88 46.35,17.88 45.47,19.02 v23.75,19.02 | 29.97,19.02 v23.75,19.02 | v23.75,19.02 23.5,19.02 v14.99,19.02 14.22,19.02 11.95,20.99 v9.65,22.96 | IC2.8 62.74,12.29 62.61,12.42 61.34,14.07 61.47,20.68 62.61,21.95 68.71,21.95 69.34,22.58 69.34,31.85 68.2,32.99 65.79,32.99 IC1.8 68.2,33.12 69.6,34.52 v69.6,39.47
  Bottom 0.813: v52.96,33.25 50.16,33.25 v49.78,32.87 | IC2.8 70.36,12.29 v70.61,12.55
LEDA  (via drill 0.6)
  Top 0.305: R2.2 30.99,34.65 29.46,36.17 29.46,38.46 v29.34,38.58
  Bottom 0.305: v29.34,38.58 19.43,38.58 14.35,43.66 6.81,43.66 X1.9
LEDB  (via drill 0.6)
  Top 0.305: R10.2 v30.73,37.57
  Bottom 0.305: v30.73,37.57 25.53,37.57 24.13,36.17 24.13,31.72 20.32,27.91 12.32,27.91 9.53,30.71 7.11,30.71 5.84,29.44 5.84,28.5 X1.12
N$1
  Top 0.305: Q1.1 37.08,38.19 C2.1 38.98,35.8 38.99,35.92 38.99,34.65 40.28,33.22 U1.24
N$2  (via drill 0.6)
  Top 0.305: Q1.2 46.48,39.73 C1.1 46.73,36.55 v44.58,36.55 | U1.23 40.94,34.1 v40.51,34.77
  Bottom 0.305: v40.51,34.77 40.13,35.15 41.15,36.55 v44.58,36.55
N$3
  pour Bottom: 0,44.04 0,0.1 93.47,0.1 93.47,44.04
N$4  (via drill 0.6)
  Top 0.305: U1.8 42.23,22.89 44.2,20.93 44.2,14.33 v44.07,14.07 | v31.88,11.66 31.75,11.79 29.59,13.31 U2.17
  Bottom 0.305: J2.3 20.9,5.82 22.43,5.82 25.63,8.97 29.49,8.97 31.24,10.9 v31.88,11.66 43.43,11.66 44.07,12.42 v44.07,14.07
N$5  (via drill 0.6)
  Top 0.305: R1.1 19.68,14.2 21.08,15.21 22.73,15.21 23.37,14.71 23.37,8.61 23.39,8.31 | 23.39,8.31 23.4,8.07 22.99,7.65 J2.5 | U2.29 33.42,7.5 v33.05,7.87 | v25.12,6.68 25.01,6.68 23.39,8.31
  Bottom 0.305: v33.05,7.87 32.49,7.87 31.73,7.11 31.67,7.11 31.17,6.6 25.2,6.6 v25.12,6.68
N$6
  Top 0.305: U1.27 38.34,33.14 36.83,34.65 R2.1
N$7
  pour Top: 0,44.04 0,0.1 93.47,0.1 93.47,44.04
N$8
  Top 0.305: U1.26 38.98,33.63 38.86,33.76 35.18,37.57 R10.1
N$9
  Top 0.305: R3.2 27.82,39.85 R4.1 27.82,35.79 C4.1
N$13  (via drill 0.6)
  Top 0.305: 41.3,18.16 41.78,18.64 41.78,20.31 R7.2 | v41.27,8.86 41.3,10.16 41.3,18.16 | v33.27,20.29 27.94,20.29 27.3,19.66 27.3,17.25 28.32,16.23 29.97,16.23 30.22,15.98 U2.16 | v38.48,20.04 38.99,19.53 38.99,18.64 39.47,18.16 41.3,18.16
  Bottom 0.305: J2.1 16.38,6.17 16.36,5.69 16.99,5.08 23.5,5.08 24.51,5.11 40.31,5.16 41.27,6.07 v41.27,8.86 | v33.27,20.29 33.53,20.04 v38.48,20.04
N$14
  Top 0.305: U1.6 40.94,22.49 40.13,21.69 40.13,20.54 R7.1
N$15  (via drill 0.6)
  Top 0.305: v42.8,17.88 43.43,18.64 43.43,20.68 41.59,22.52 U1.7 | v22.48,13.82 21.34,13.82 18.92,11.66 J2.4 | v28.32,17.88 28.32,17.37 28.83,16.87 30.48,16.87 31.02,16.33 U2.15
  Bottom 0.305: v42.8,17.88 v28.32,17.88 25.81,17.88 v22.48,13.82
N$16  (via drill 0.6)
  Top 0.305: U1.9 42.88,23.26 44.96,21.18 v44.96,13.06 | v34.04,10.64 31.88,12.8 31.88,14.75 U2.14
  Bottom 0.305: v44.96,13.06 44.58,12.67 44.58,11.66 44.07,10.9 41.53,10.9 41.4,10.64 v34.04,10.64
N$19  (via drill 0.6)
  Top 0.305: 50.53,28.68 R8.1 49.28,28.67 v48.39,27.79 | U1.10 43.53,23.62 45.97,21.18 45.97,19.91 46.48,19.41 v46.99,19.41
  Bottom 0.305: v46.99,19.41 48.39,21.18 v48.39,27.79
N$20
  Top 0.61: R15.1 LED1.A
N$22
  Top 0.305: U1.14 46.13,24.21 R9.2
N$23
  Top 0.305: C5.1 36.88,24.12 U1.1
N$24
  Top 0.305: U1.3 38.98,22.32 37.47,20.29 37.47,19.28 38.99,17.75 38.99,12.93 38.58,12.52 U2.7
N$25
  Top 0.813: IC3.1 2.41,1.88 3.43,1.12 8.64,1.12 9.53,1.75 JP1.1 10.36,6.05 C10.+
N$27
  Top 0.305: R11.1 IC2.1
N$28
  Top 0.305: R12.1 IC2.15
N$30
  Top 0.305: R13.1 IC1.1
N$31
  Top 0.305: R14.1 IC1.15
N-COM  (via drill 0.6)
  Top 0.305: U1.16 45.48,30.35 44.2,29.06 35.05,29.06 v33.02,27.03 | v25.91,30.84 24.51,29.44 24.51,28.68 R5.1 23.86,27.28 22.86,26.01 21.08,26.01 19.18,28.17 16.38,28.17 13.72,30.07 13.72,34.19 13.79,34.26 14.4,34.9 15.7,34.9 16.99,36.19 16.99,36.91 X1.2
  Bottom 0.305: v33.02,27.03 31.88,27.03 31.37,27.53 31.37,30.2 30.86,30.84 v25.91,30.84
RD+  (via drill 0.6)
  Top 0.305: U1.13 45.48,25.99 45.47,27.51 44.83,28.04 v35.56,28.04 | v26.54,34.9 26.04,35.4 R4.2 | R4.2 26.16,37.69 | R4.2 25.02,37.69 24.51,37.19 24.51,33.38 23.62,32.49 21.97,32.49 21.59,32.87 21.59,33.63 21.21,34.01 18.67,34.01 18.16,33.5 16.76,33.5 15.24,31.98 15.24,31.34 X1.7
  Bottom 0.305: v35.56,28.04 31.88,31.22 31.88,34.26 31.24,34.9 v26.54,34.9
RD-  (via drill 0.6)
  Top 0.305: v18.92,35.53 21.21,37.82 23.5,37.82 27.18,41.5 28.31,41.5 R3.1 28.59,41.5 v30.23,41.5 | U1.12 44.84,26.39 v44.07,27.03
  Bottom 0.305: v44.07,27.03 38.61,27.03 32.77,31.85 32.77,38.96 v30.23,41.5 | v18.92,35.53 18.92,31.22 X1.8
SEN_1
  Top 0.305: U2.27 31.82,5.1 30.81,4.09 30.81,3.57 R18.2 29.45,3.36 29.16,3.07 27.41,3.07 25.12,5.13 20.47,5.13 JP3.1
SEN_2
  Top 0.305: U2.28 32.62,4.35 R17.2 32.55,2.49 27.1,2.49 24.84,4.5 21.08,4.5 20.78,4.11 JP3.2
SENS_IN
  Top 0.305: U2.22 27.74,9.32 26.54,8.08 R16.2 24.5,8.11 24.13,8.48 24.13,10.77 JP2.1
TD+  (via drill 0.6)
  Top 0.305: R6.2 26.93,24.73 v25.02,24.74 | U1.17 44.84,30.97 43.69,29.82 34.31,29.82 29.84,24.74 29.34,24.74 29.21,24.73 R6.2 | 27.69,24.87 R6.2 | v20.07,25.5 18.67,25.5 12.95,29.57 12.95,36.93 X1.1
  Bottom 0.305: v25.02,24.74 21.08,24.74 v20.07,25.5
TD-
  Top 0.305: C3.2 26.3,28.91 R5.2 27.05,28.04 27.69,27.41 R6.1 24.77,26.53 L1.1 18.78,24.5 12.19,29.31 12.19,38.2 16.28,41.63 17.91,41.58 18.9,40.56 18.87,39.73 17.6,38.48 16.82,38.48 14.86,36.53 X1.3
VCC  (via drill 0.6)
  Top 0.305: R8.2 48.76,30.47 46.99,31.85 46.46,31.85 U1.15 | U1.25 39.63,30.85 | 39.63,30.85 39.37,30.58 38.1,30.58 37.59,31.09 37.59,32.08 U1.28 37.37,32.49 C9.1 | U1.20 42.88,31.05 42.67,30.84 | 42.67,30.84 42.42,30.58 39.9,30.58 39.63,30.85 | U1.19 43.53,30.94 43.18,30.58 42.93,30.58 42.67,30.84 | J2.2 16.38,10.26 17.91,11.91 17.91,14.06 R1.2
  Top 0.406: U1.19 42.93,32.17 42.93,33.5 v43.18,33.76 | 17.91,14.06 17.91,15.09 17.53,15.47 17.53,22.71 17.02,23.22
  Top 0.61: R8.2 50.55,30.45 51.82,31.34 v51.82,35.66 51.82,41.12 49.91,43.03 16.51,43.03 11.3,38.84 11.3,28.8 15.37,25.76 15.37,23.34 15.37,23.22 17.02,23.22 22.72,23.22 L1.2
  Top 0.813: IC4.3 8.33,16.43 9.14,16.48 R15.2 10.16,18.39 11.68,19.66 11.68,20.54 C6.1 11.67,21.81 13.08,23.22 15.24,23.22 15.37,23.34
  Bottom 0.406: v43.18,33.76 48.39,33.76 50.29,35.66 v51.82,35.66